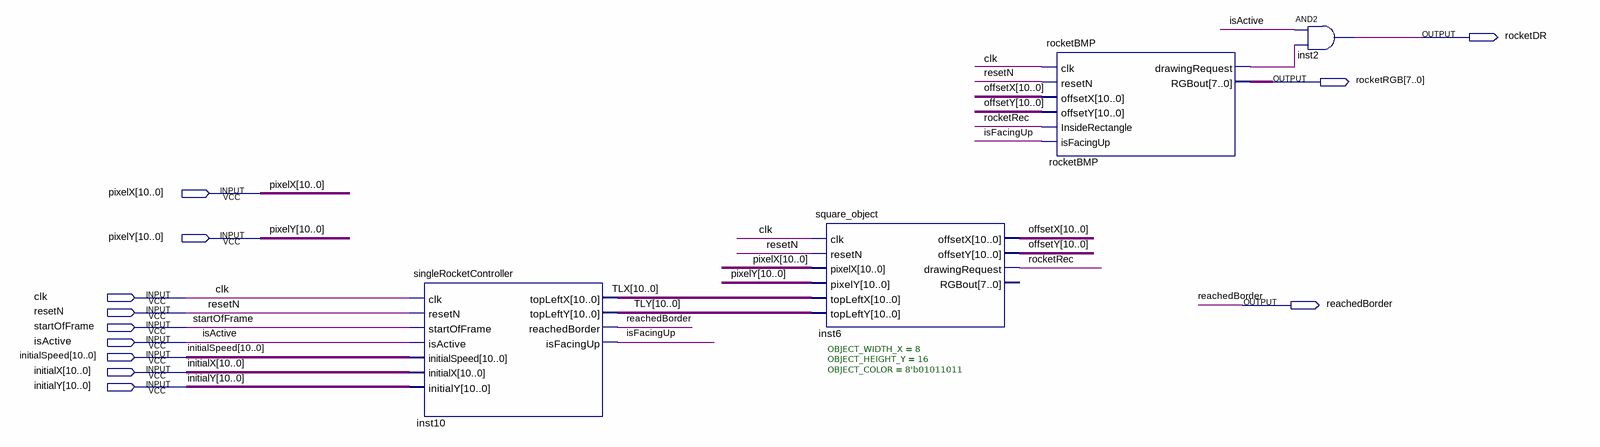
[diagram p0: schematic sheet]
// Quartus schematic Single_rocket.bdf as structural Verilog: 4 symbols, 12 pins
module Single_rocket (
  input  [10:0] pixelX,
  input  [10:0] pixelY,
  input  clk,
  input  resetN,
  input  startOfFrame,
  input  isActive,
  input  [10:0] initialSpeed,
  input  [10:0] initialX,
  input  [10:0] initialY,
  output rocketDR,
  output [7:0] rocketRGB,
  output reachedBorder
);

  wire isFacingUp, rocketBMP_drawingrequest, rocketRec;
  wire [10:0] offsetX, offsetY, TLX, TLY;

  singleRocketController inst10 (
    .clk(clk), .resetN(resetN), .startOfFrame(startOfFrame), .isActive(isActive),
    .initialSpeed(initialSpeed), .initialX(initialX), .initialY(initialY), .topLeftX(TLX), .topLeftY(TLY),
    .reachedBorder(reachedBorder), .isFacingUp(isFacingUp));
  square_object #(.OBJECT_WIDTH_X(8), .OBJECT_HEIGHT_Y(16), .OBJECT_COLOR(8'b01011011)) inst6 (
    .clk(clk), .resetN(resetN), .pixelX(pixelX), .pixelY(pixelY), .topLeftX(TLX), .topLeftY(TLY),
    .offsetX(offsetX), .offsetY(offsetY), .drawingRequest(rocketRec));  // open: RGBout
  rocketBMP rocketBMP (
    .clk(clk), .resetN(resetN), .offsetX(offsetX), .offsetY(offsetY), .InsideRectangle(rocketRec),
    .isFacingUp(isFacingUp), .drawingRequest(rocketBMP_drawingrequest), .RGBout(rocketRGB));
  and inst2 (rocketDR, isActive, rocketBMP_drawingrequest);
endmodule
